# EAGLE design Energy Sensor (EAGLE 6.4)
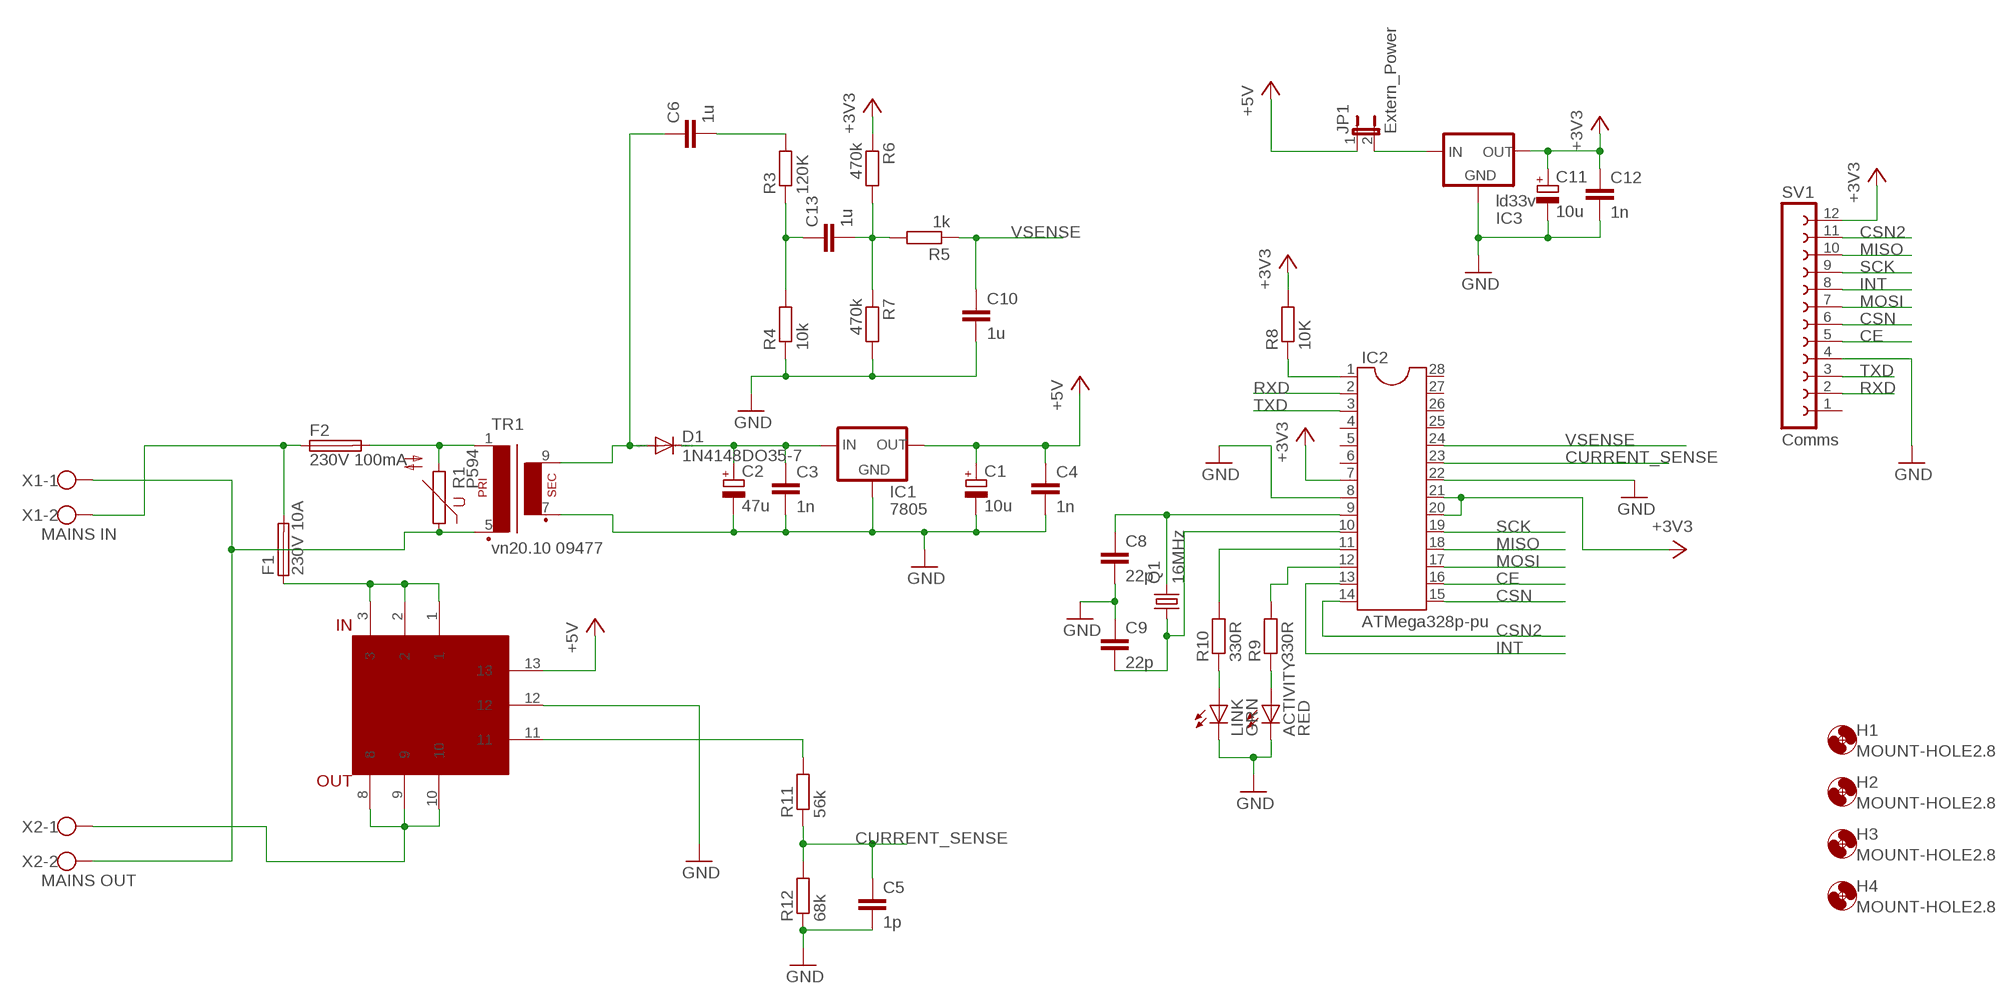
[diagram p0: schematic, sheet 1]

## Parts
ACTIVITY  RED  LED5MM  [LED5MM]
C1  10u  CPOL-EUE2.5-6  [E2,5-6]
C2  47u  CPOL-EUE2.5-6  [E2,5-6]
C3  1n  C-EU025-025X050  [C025-025X050]
C4  1n  C-EU025-025X050  [C025-025X050]
C5  1p  C-EU025-025X050  [C025-025X050]
C6  1u  C-EU025-025X050  [C025-025X050]
C8  22p  C-EU025-025X050  [C025-025X050]
C9  22p  C-EU025-025X050  [C025-025X050]
C10  1u  C-EU025-025X050  [C025-025X050]
C11  10u  CPOL-EUE2.5-6  [E2,5-6]
C12  1n  C-EU025-025X050  [C025-025X050]
C13  1u  C-EU025-025X050  [C025-025X050]
D1  1N4148DO35-7  [DO35-7]
F1  230V 10A  SH22,5A  [SH22,5A]
F2  230V 100mA  SH22,5A  [SH22,5A]
H1  MOUNT-HOLE2.8  [2,8]
H2  MOUNT-HOLE2.8  [2,8]
H3  MOUNT-HOLE2.8  [2,8]
H4  MOUNT-HOLE2.8  [2,8]
IC1  7805  78XXL  [78XXL]
IC2  ATMega328p-pu  DIL28-3  [DIL28-3]
IC3  ld33v  79XXL  [79XXL]
JP1  Extern_Power  JP1E  [JP1]
LINK  GRN  LED5MM  [LED5MM]
Q1  16MHz  CRYSTALHC49S  [HC49/S]
R1  P594  [P594]
R3  120K  R-EU_0207/7  [0207/7]
R4  10k  R-EU_0207/7  [0207/7]
R5  1k  R-EU_0207/7  [0207/7]
R6  470k  R-EU_0207/7  [0207/7]
R7  470k  R-EU_0207/7  [0207/7]
R8  10K  R-EU_0207/7  [0207/7]
R9  330R  R-EU_0207/7  [0207/7]
R10  330R  R-EU_0207/7  [0207/7]
R11  56k  R-EU_0207/7  [0207/7]
R12  68k  R-EU_0207/7  [0207/7]
SV1  Comms  FE12W  [FE12W]
TR1  vn20.10 09477  VV11  [VV11]
U$1  CAS25-NP  [CAS]
X1  MAINS IN  W237-102  [W237-102]
X2  MAINS OUT  W237-102  [W237-102]

## Nets
+3V3: C11.+ C12.1 IC2.7 IC2.20 IC2.21 IC3.OUT R6.1 R8.2 SV1.12
+5V: C1.+ C4.1 IC1.OUT JP1.1 U$1.13
CE: IC2.16 SV1.5
CSN: IC2.15 SV1.6
CSN2: IC2.14 SV1.11
CURRENT_SENSE: C5.1 IC2.23 R11.1 R12.2
GND: ACTIVITY.K(C) C1.- C2.- C3.2 C4.2 C5.2 C8.2 C9.1 C10.2 C11.- C12.2 IC1.GND IC2.8 IC2.22 IC3.GND LINK.K(C) R4.1 R7.2 R12.1 SV1.4 TR1.7(S3) U$1.12
INT: IC2.13 SV1.8
MISO: IC2.18 SV1.10
MOSI: IC2.17 SV1.7
N$2: R1.1 TR1.5(P2) X1.1 X2.2
N$3: IC3.IN JP1.2
N$4: C6.2 R3.2
N$5: C6.1 D1.A TR1.9(S4)
N$6: F1.1 U$1.1 U$1.2 U$1.3
N$7: C2.+ C3.1 D1.C IC1.IN
N$8: U$1.8 U$1.9 U$1.10 X2.1
N$9: C13.1 R3.1 R4.2
N$10: C13.2 R5.2 R6.2 R7.1
N$11: R11.2 U$1.11
N$12: C8.1 IC2.9 Q1.2
N$13: C9.2 IC2.10 Q1.1
N$14: LINK.A R10.1
N$15: ACTIVITY.A R9.1
N$16: IC2.1 R8.1
N$17: IC2.12 R9.2
N$18: IC2.11 R10.2
N$19: F2.2 R1.2 TR1.1
N$22: F1.2 F2.1 X1.2
RXD: IC2.2 SV1.2
SCK: IC2.19 SV1.9
TXD: IC2.3 SV1.3
VSENSE: C10.1 IC2.24 R5.1
Unconnected: IC2.4 IC2.5 IC2.6 IC2.25 IC2.26 IC2.27 IC2.28 SV1.1

## Library data of the parts
ACTIVITY LINK = led:LED: LED OSRAM: - CHIPLED LG R971, LG N971, LY N971, LG Q971, LY Q971, LO R971, LY R971 LH N974, LH R974 LS Q976, LO Q976, LY Q976 LO Q996 - Hyper CHIPLED LW Q18S LB Q993, LB Q99A, LB R99A - SideLED LS A670, LO A670, LY A670, LG A670, LP A670 LB A673, LV A673, LT A673, LW A673 LH A674 LY A675 LS A676, LA A676, LO A676, LY A676, LW A676 LS A679, LY A679, LG A679 - Hyper Micro SIDELED® LS Y876, LA Y876, LO Y876, LY Y876 LT Y87S - SmartLED LW L88C, LW L88S LB L89C, LB L89S, LG L890 LS L89K, LO L89K, LY L89K LS L896, LA L896, LO L896, LY L896 - TOPLED LS T670, LO T670, LY T670, LG T670, LP T670 LSG T670, LSP T670, LSY T670, LOP T670, LYG T670 LG T671, LOG T671, LSG T671 LB T673, LV T673, LT T673, LW T673 LH T674 LS T676, LA T676, LO T676, LY T676, LB T676, LH T676, LSB T676, LW T676 LB T67C, LV T67C, LT T67C, LS T67K, LO T67K, LY T67K, LW E67C LS E67B, LA E67B, LO E67B, LY E67B, LB E67C, LV E67C, LT E67C LW T67C LS T679, LY T679, LG T679 LS T770, LO T770, LY T770, LG T770, LP T770 LB T773, LV T773, LT T773, LW T773 LH T774 LS E675, LA E675, LY E675, LS T675 LS T776, LA T776, LO T776, LY T776, LB T776 LHGB T686 LT T68C, LB T68C - Hyper Mini TOPLED® LB M676 - Mini TOPLED Santana® LG M470 LS M47K, LO M47K, LY M47K Source: http://www.osram.convergy.de LUXEON: - LUMILED® LXK2-PW12-R00, LXK2-PW12-S00, LXK2-PW14-U00, LXK2-PW14-V00 LXK2-PM12-R00, LXK2-PM12-S00, LXK2-PM14-U00 LXK2-PE12-Q00, LXK2-PE12-R00, LXK2-PE12-S00, LXK2-PE14-T00, LXK2-PE14-U00 LXK2-PB12-K00, LXK2-PB12-L00, LXK2-PB12-M00, LXK2-PB14-N00, LXK2-PB14-P00, LXK2-PB14-Q00 LXK2-PR12-L00, LXK2-PR12-M00, LXK2-PR14-Q00, LXK2-PR14-R00 LXK2-PD12-Q00, LXK2-PD12-R00, LXK2-PD12-S00 LXK2-PH12-R00, LXK2-PH12-S00 LXK2-PL12-P00, LXK2-PL12-Q00, LXK2-PL12-R00 Source: www.luxeon.com KINGBRIGHT: KA-3528ASYC Source: www.kingbright.com
C1 C2 C11 = rcl:CPOL-EU: POLARIZED CAPACITOR, European symbol
C3-C6 C8-C10 C12 C13 = rcl:C-EU: CAPACITOR, European symbol
D1 = diode:1N4148: DIODE high speed (Philips)
F1 F2 = fuse:SH22,5A: FUSE HOLDER grid 22,5mm, isolated cap OGN0031 8201, Schurter (Buerklin); MPN: 0031.7701.11; OC_FARNELL: unknown; OC_NEWARK: 04F1224
H1-H4 = holes:MOUNT-HOLE: MOUNTING HOLE with drill center marker
IC1 = v-reg:78XXL: VOLTAGE REGULATOR
IC2 = ic-package:DIL28: Dual In Line
IC3 = v-reg:79XXL: VOLTAGE REGULATOR
JP1 = jumper:JP1E: JUMPER
Q1 = crystal:CRYSTAL: CRYSTAL; OC_FARNELL: 1667008; OC_NEWARK: unknown
R1 = varistor:P594: VARISTOR
R3-R12 = rcl:R-EU_: RESISTOR, European symbol
SV1 = con-lsta:FE12W: FEMALE HEADER; OC_FARNELL: unknown; OC_NEWARK: unknown
TR1 = xformer:VV11: TRANSFORMER 1 primary winding, 1 secondary winding BLOCK
U$1 = CAS:CAS25-NP
X1 X2 = con-wago-500:W237-102: WAGO SCREW CLAMP; MPN: 237-102; OC_FARNELL: unknown; OC_NEWARK: 70K9898

## Board
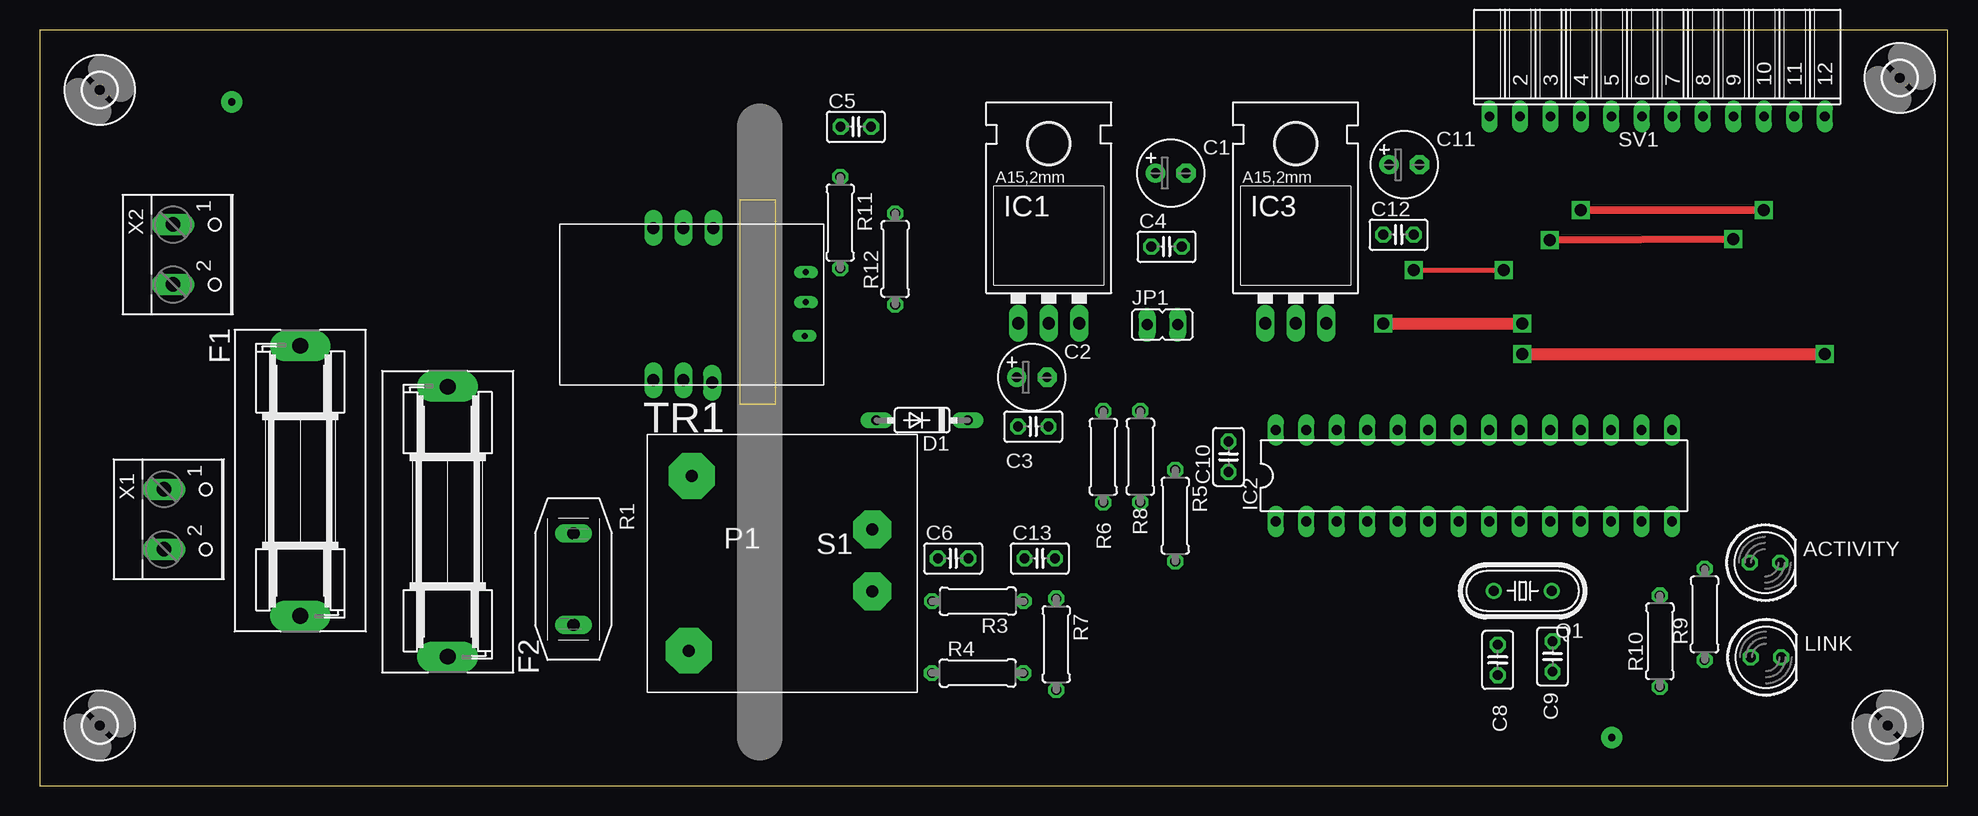
[diagram p1: board, top side]
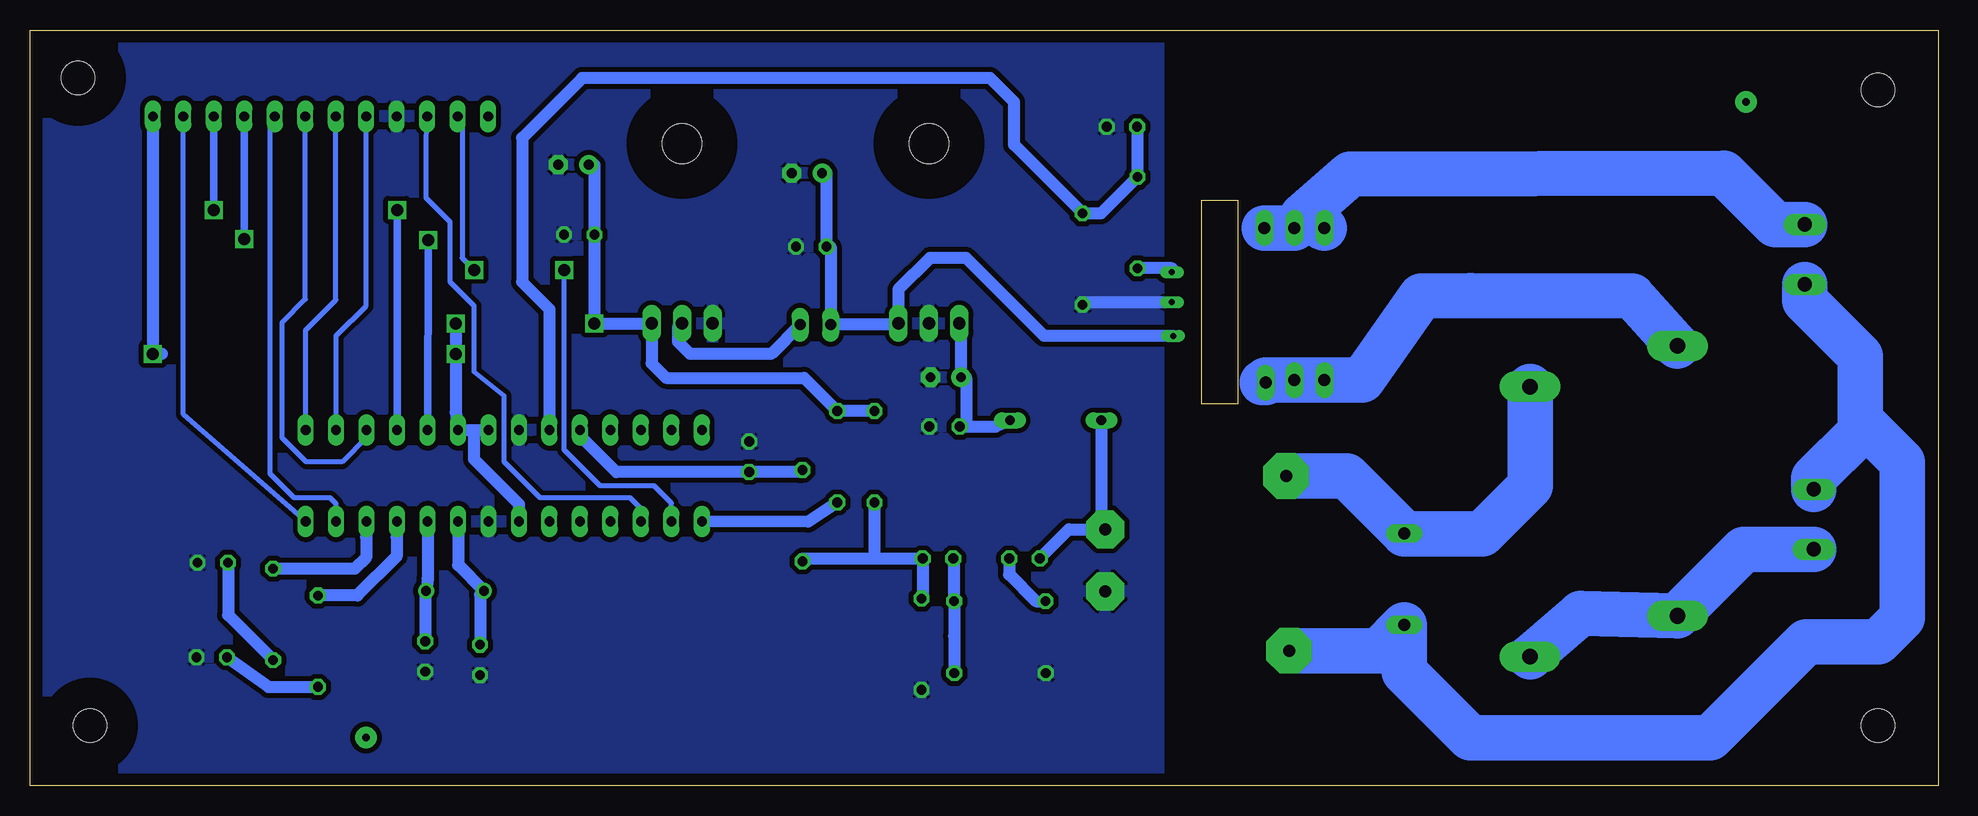
[diagram p2: board, bottom side, seen from below]

Size 159 x 63 mm. Coordinates in mm from the lower left corner, seen from the top.
Outline: 0,0 159,0 159,63 0,63 0,0
Copper layers (1*16): Top 0.035mm / dielectric 1.5mm / Bottom 0.035mm
Design rules "default": minimum track width 10mil, minimum drill 24mil, track to track 8mil, track to pad 8mil, pad to pad 8mil, via to via 8mil, smd to smd 8mil, copper to edge 40mil, drill to drill 8mil, minimum pad ring 10mil, minimum via ring 8mil, stop-mask expansion 4mil, vias tented up to drill 0mil, thermal gap 10mil

### Footprints (pad centres in the part's own frame; a part is rotated, then mirrored left to right if it is on the bottom)
LED5MM = drill 0.813 octagon: A -1.27,0; K 1.27,0
E2,5-6 = drill 0.813 pad 1.6: + -1.27,0 | drill 0.813 pad 1.6 octagon: - 1.27,0
C025-025X050 = drill 0.813 octagon: 1 -1.27,0; 2 1.27,0
DO35-7 = drill 0.813 long: A 3.81,0; C -3.81,0
SH22,5A = drill 1.321 pad 2.54 long: 1 -11.252,0; 2 11.252,0
2,8 = hole 2.8: 0,0
78XXL = drill 1.016 long: GND 0,-3.81; IN -2.54,-3.81; OUT 2.54,-3.81 | hole 3.302: 0,11.176
DIL28-3 = drill 0.813 long: 1 -16.51,-3.81; 2 -13.97,-3.81; 3 -11.43,-3.81; 4 -8.89,-3.81; 5 -6.35,-3.81; 6 -3.81,-3.81; 7 -1.27,-3.81; 8 1.27,-3.81; 9 3.81,-3.81; 10 6.35,-3.81; 11 8.89,-3.81; 12 11.43,-3.81; 13 13.97,-3.81; 14 16.51,-3.81; 15 16.51,3.81; 16 13.97,3.81; 17 11.43,3.81; 18 8.89,3.81; 19 6.35,3.81; 20 3.81,3.81; 21 1.27,3.81; 22 -1.27,3.81; 23 -3.81,3.81; 24 -6.35,3.81; 25 -8.89,3.81; 26 -11.43,3.81; 27 -13.97,3.81; 28 -16.51,3.81
79XXL = drill 1.016 long: GND -2.54,-3.81; IN 0,-3.81; OUT 2.54,-3.81 | hole 3.302: 0,11.176
JP1 = drill 0.914 long: 1 0,-1.27; 2 0,1.27
HC49/S = drill 0.813: 1 -2.413,0; 2 2.413,0
P594 = drill 1.016 long: 1 0,3.81; 2 0,-3.81
0207/7 = drill 0.813 octagon: 1 -3.81,0; 2 3.81,0
FE12W = drill 0.813 long: 1 -13.97,0; 2 -11.43,0; 3 -8.89,0; 4 -6.35,0; 5 -3.81,0; 6 -1.27,0; 7 1.27,0; 8 3.81,0; 9 6.35,0; 10 8.89,0; 11 11.43,0; 12 13.97,0
VV11 = drill 1 pad 3.81 octagon: 1 3.687,18.043; 5 3.437,3.477 | drill 1 pad 3.175 octagon: 7 18.753,8.43; 9 18.753,13.59
CAS = drill 1 long: 1 9.3,13.2; 2 11.7,13; 3 14.2,13; 8 14.2,0.3; 9 11.7,0.3; 10 9.2,0.3 | drill 0.5 long: 11 1.5,4; 12 1.5,6.5; 13 1.6,9.3
W237-102 = drill 1.194 long: 1 -2.5,-1.27; 2 2.5,-1.27

### Placement (x,y rotation side)
ACTIVITY  143.77,18.58 0 top
C1  94.26,51.07 0 top
C2  82.68,34.04 0 top
C3  82.79,29.93 0 top
C4  93.9,44.93 0 top
C5  68.01,54.93 0 top
C6  76.12,18.93 0 top
C8  121.5,10.47 270 top
C9  126.07,10.76 90 top
C10  99.07,27.41 90 top
C11  113.71,51.77 0 top
C12  113.23,45.93 0 top
C13  83.34,18.93 0 top
D1  73.53,30.45 180 top
F1  21.71,25.41 270 top
F2  34,22 90 top
H1  5,58 0 top
H2  5,5 0 top
H3  154,5 0 top
H4  155,59 0 top
IC1  84.09,42.35 0 top
IC2  119.52,25.83 0 top
IC3  104.66,42.35 0 top
JP1  93.55,38.42 270 top
LINK  143.85,10.69 0 top
Q1  123.58,16.23 180 top
R1  44.48,17.2 180 top
R3  78.18,15.37 180 top
R4  78.16,9.38 0 top
R5  94.63,22.5 270 top
R6  88.63,27.41 270 top
R7  84.71,11.78 270 top
R8  91.72,27.42 90 top
R9  138.74,14.27 90 top
R10  135.01,12.03 90 top
R11  66.71,46.94 270 top
R12  71.29,43.9 90 top
SV1  134.79,55.8 0 top
TR1  50.64,7.77 0 top
U$1  65.34,46.8 180 top
X1  11.62,22.2 270 top
X2  12.37,44.28 270 top

### Tracks (layer width: path | path; a pad name or v marks a point on that pad's centre or on a via)
+3V3  (via drill 1)
  Top 1.016: v111.96,38.54 v123.54,38.54 | v123.54,36 v148.76,36
  Bottom 1.016: C11.+ 111.96,51.77 C12.1 v111.96,38.54 IC3.OUT 107.2,35.2 106,34 94.49,34 R8.2 R6.1 | v123.54,38.54 v123.54,36 123.54,31.12 IC2.20 122,29.64 | SV1.12 v148.76,36 | v148.76,36 149,36 | 148,36 v148.76,36 | 122,29.64 IC2.21 | IC2.7 118.25,23.45 122,27.2 122,29.64
+5V
  Bottom 1.016: JP1.1 86.63,38.42 IC1.OUT 86.63,41.37 84,44 81,44 74.5,37.5 U$1.13 | 92,38.42 JP1.1 | C1.+ 92.63,51.07 C4.1 92.28,44.93 JP1.1
CE
  Bottom 0.406: IC2.16 133.49,37.51 131,40 131,55.78 SV1.5
CSN
  Bottom 0.406: IC2.15 136.03,37.97 133.52,40.48 SV1.6
CSN2
  Bottom 0.406: IC2.14 146.22,30.94 SV1.11
CURRENT_SENSE
  Bottom 1.016: C5.1 66.74,50.75 R11.1 69.75,47.71 R12.2 77,53.42 77,57 79,59 113,59 118,54 118,42 115.71,39.71 IC2.23
GND
  Bottom 1.016: TR1.7 69.39,16 | R12.1 71.29,40.3 U$1.12
  pour Bottom (isolate 0.406): 65,62 65,1 158,1 158,62
INT
  Bottom 0.406: IC2.13 133.49,23.49 134,24 137,24 139,26 139,55.4 SV1.8
MISO  (via drill 1)
  Top 0.61: v128.41,48 v143.68,48
  Bottom 0.61: SV1.10 v143.68,48 143.7,48 | IC2.18 v128.41,48
MOSI
  Bottom 0.406: IC2.17 130.95,29.05 133,27 136,27 138,29 138,38.6 136.05,40.55 SV1.7
N$2
  Bottom 3.81: TR1.5 46.62,11.25 R1.1 44.48,9.48 39,4 19,4 11,12 5,12 3,14 3,27 6,30 6.5,29.5 | 6.5,29.5 6.5,35.82 11.1,40.42 X2.2 | X1.1 10.35,25.65 6.5,29.5
N$3
  Bottom 1.016: JP1.2 97.24,36 104,36 105,37 105,38.2 IC3.IN
N$4
  Bottom 1.016: C6.2 77.39,17.61 77.4,17.6 75.17,15.37 R3.2
N$5
  Bottom 1.016: D1.A 69.72,21.36 TR1.9 72.42,21.36 C6.1
N$6
  Bottom 3.81: U$1.2 56.04,33.8 U$1.1 56.33,33.6 | U$1.2 U$1.3 | U$1.2 48,33.8 43.05,40.8 38.95,40.85 25.48,40.8 F1.1 | 54.33,33.8 U$1.2
N$7
  Bottom 1.016: IC1.IN 81.41,38.54 C2.+ 81,34.04 81,29.93 | C3.1 81,29.93 | 81,29.93 78.55,29.93 D1.C
N$8
  Bottom 3.81: U$1.8 53,47.5 | 53,47.5 U$1.9 U$1.10 | 53,47.5 49,51 17.85,51.05 13.58,46.78 X2.1
N$9
  Bottom 1.016: R4.2 81.99,12.47 R3.1 81.99,18.93 C13.1
N$10
  Bottom 1.016: R7.1 84.61,15.59 C13.2 88.63,18.93 | R6.2 88.63,18.93 | R5.2 94.63,18.93 88.63,18.93
N$11
  Bottom 1.016: U$1.11 63.84,43.13 R11.2
N$12
  Bottom 1.016: C8.1 121.5,15.9 Q1.2 123.33,18.39 IC2.9
N$13
  Bottom 1.016: IC2.10 125.87,17.23 Q1.1 126.07,16.15 C9.2
N$14
  Bottom 1.016: LINK.A 139.11,8.22 R10.1
N$15
  Bottom 1.016: ACTIVITY.A 142.5,14.22 R9.1
N$16
  Bottom 1.016: R8.1 94.18,22 IC2.1
N$17
  Bottom 1.016: IC2.12 131,20.7 131,19 131.92,18.08 R9.2
N$18
  Bottom 1.016: IC2.11 128.45,20.71 128.45,19.1 131.71,15.84 R10.2
N$19
  Bottom 3.81: TR1.1 49.28,25.81 R1.2 38,21 34,25 F2.2
N$20  (via drill 0.6 pad 1.78)
  other vias: 131,4
N$21  (via drill 0.6 pad 1.78)
  other vias: 16,57
N$22
  Bottom 3.81: F2.1 29.79,14.34 F1.2 16.17,19.7 X1.2
RXD  (via drill 1)
  Top 0.406: v114.5,43 v122,43
  Bottom 0.406: SV1.2 123,54.8 123,44 v122,43 | v114.5,43 114.5,28 111.5,25 107,25 105.55,23.55 IC2.2
SCK  (via drill 1)
  Top 0.61: v125.82,45.5 v141.14,45.55
  Bottom 0.61: SV1.9 v141.14,45.55 | IC2.19 v125.82,45.5
TXD
  Bottom 0.406: SV1.3 126,53.8 126,49 124,47 124,42 122,40 122,34.5 119.5,32.5 119.5,27 116.5,24 109,24 108.09,23.09 IC2.3
VSENSE
  Bottom 1.016: R5.1 94.8,26.14 C10.1 110.14,26.14 113,29 113,29.74 IC2.24

### Text on the board
Document: COMMS. MODULE | OUTPUT | L | N | Smart Home / Energy Meter 2015 | MAINS | N | L | 2015 Rev A
tDocu: 2015 | SmartHome | Energy Meter Rev A.